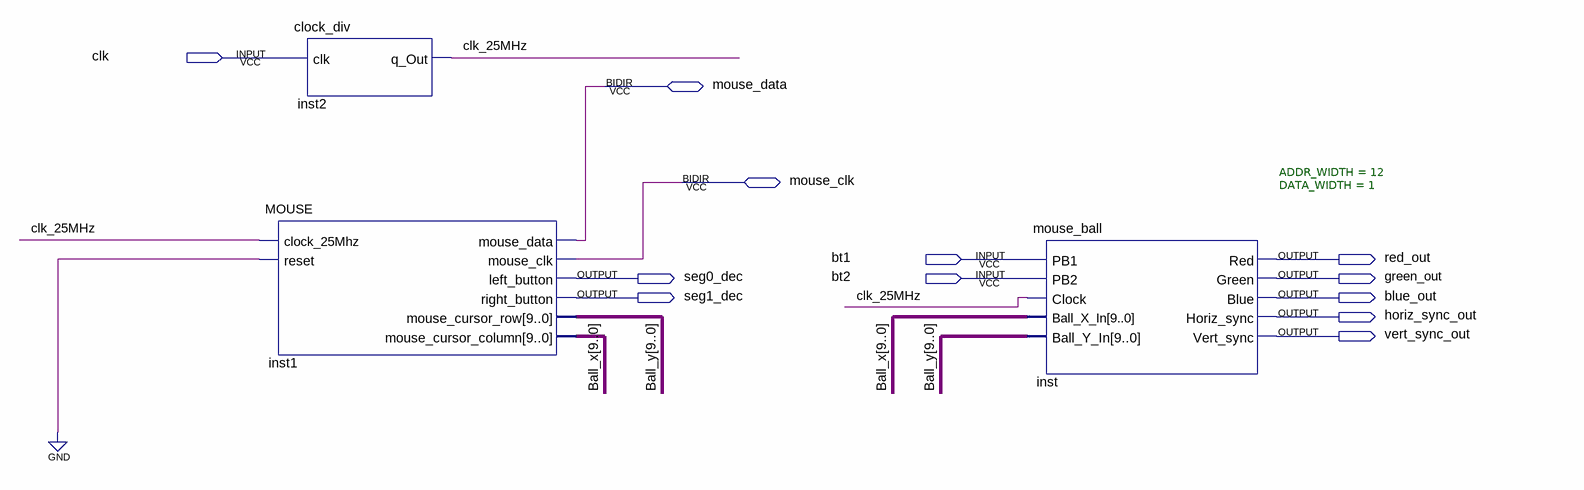
[diagram p0: schematic sheet]
// Quartus schematic Mouse_ball_diagram.bdf as structural Verilog: 3 symbols, 12 pins
module Mouse_ball_diagram (
  input  clk,
  input  bt1,
  input  bt2,
  inout  mouse_data,
  inout  mouse_clk,
  output red_out,
  output seg0_dec,
  output green_out,
  output seg1_dec,
  output blue_out,
  output horiz_sync_out,
  output vert_sync_out
);

  wire clk_25MHz;
  wire [9:0] Ball_x, Ball_y;

  clock_div inst2 (.clk(clk), .q_Out(clk_25MHz));
  MOUSE inst1 (
    .clock_25Mhz(clk_25MHz), .reset(1'b0), .left_button(seg0_dec), .right_button(seg1_dec),
    .mouse_cursor_row(Ball_y), .mouse_cursor_column(Ball_x), .mouse_data(mouse_data), .mouse_clk(mouse_clk));
  mouse_ball #(.ADDR_WIDTH(12), .DATA_WIDTH(1)) inst (
    .PB1(bt1), .PB2(bt2), .Clock(clk_25MHz), .Ball_X_In(Ball_x), .Ball_Y_In(Ball_y), .Red(red_out),
    .Green(green_out), .Blue(blue_out), .Horiz_sync(horiz_sync_out), .Vert_sync(vert_sync_out));
endmodule
